# Altium schematic sheet AWR2243_DUT.SchDoc: =ProjectTitle
size A3; PageSetup: Record=PageOptions|CenterHorizontal=True|CenterVertical=True|PrintScale=1.00|XCorrection=1.00|YCorrection=1.00|PrintKind=0|BorderSize=5000000|LeftOffset=0|BottomOffset=0|Orientation=2|PaperLength=1000|PaperWidth=1000|Scale=100|PaperSource=15|PrintQuality=600|MediaType=1|DitherType=10|PaperKind=Letter|PrintScaleMode=1; Author: Jaime I. Chait; Organization: NWES LLC; Address1: 111 SW 5th Ave, STE 3150; Address2: Portland, OR 97204; SheetNumber: 6; SheetTotal: 19
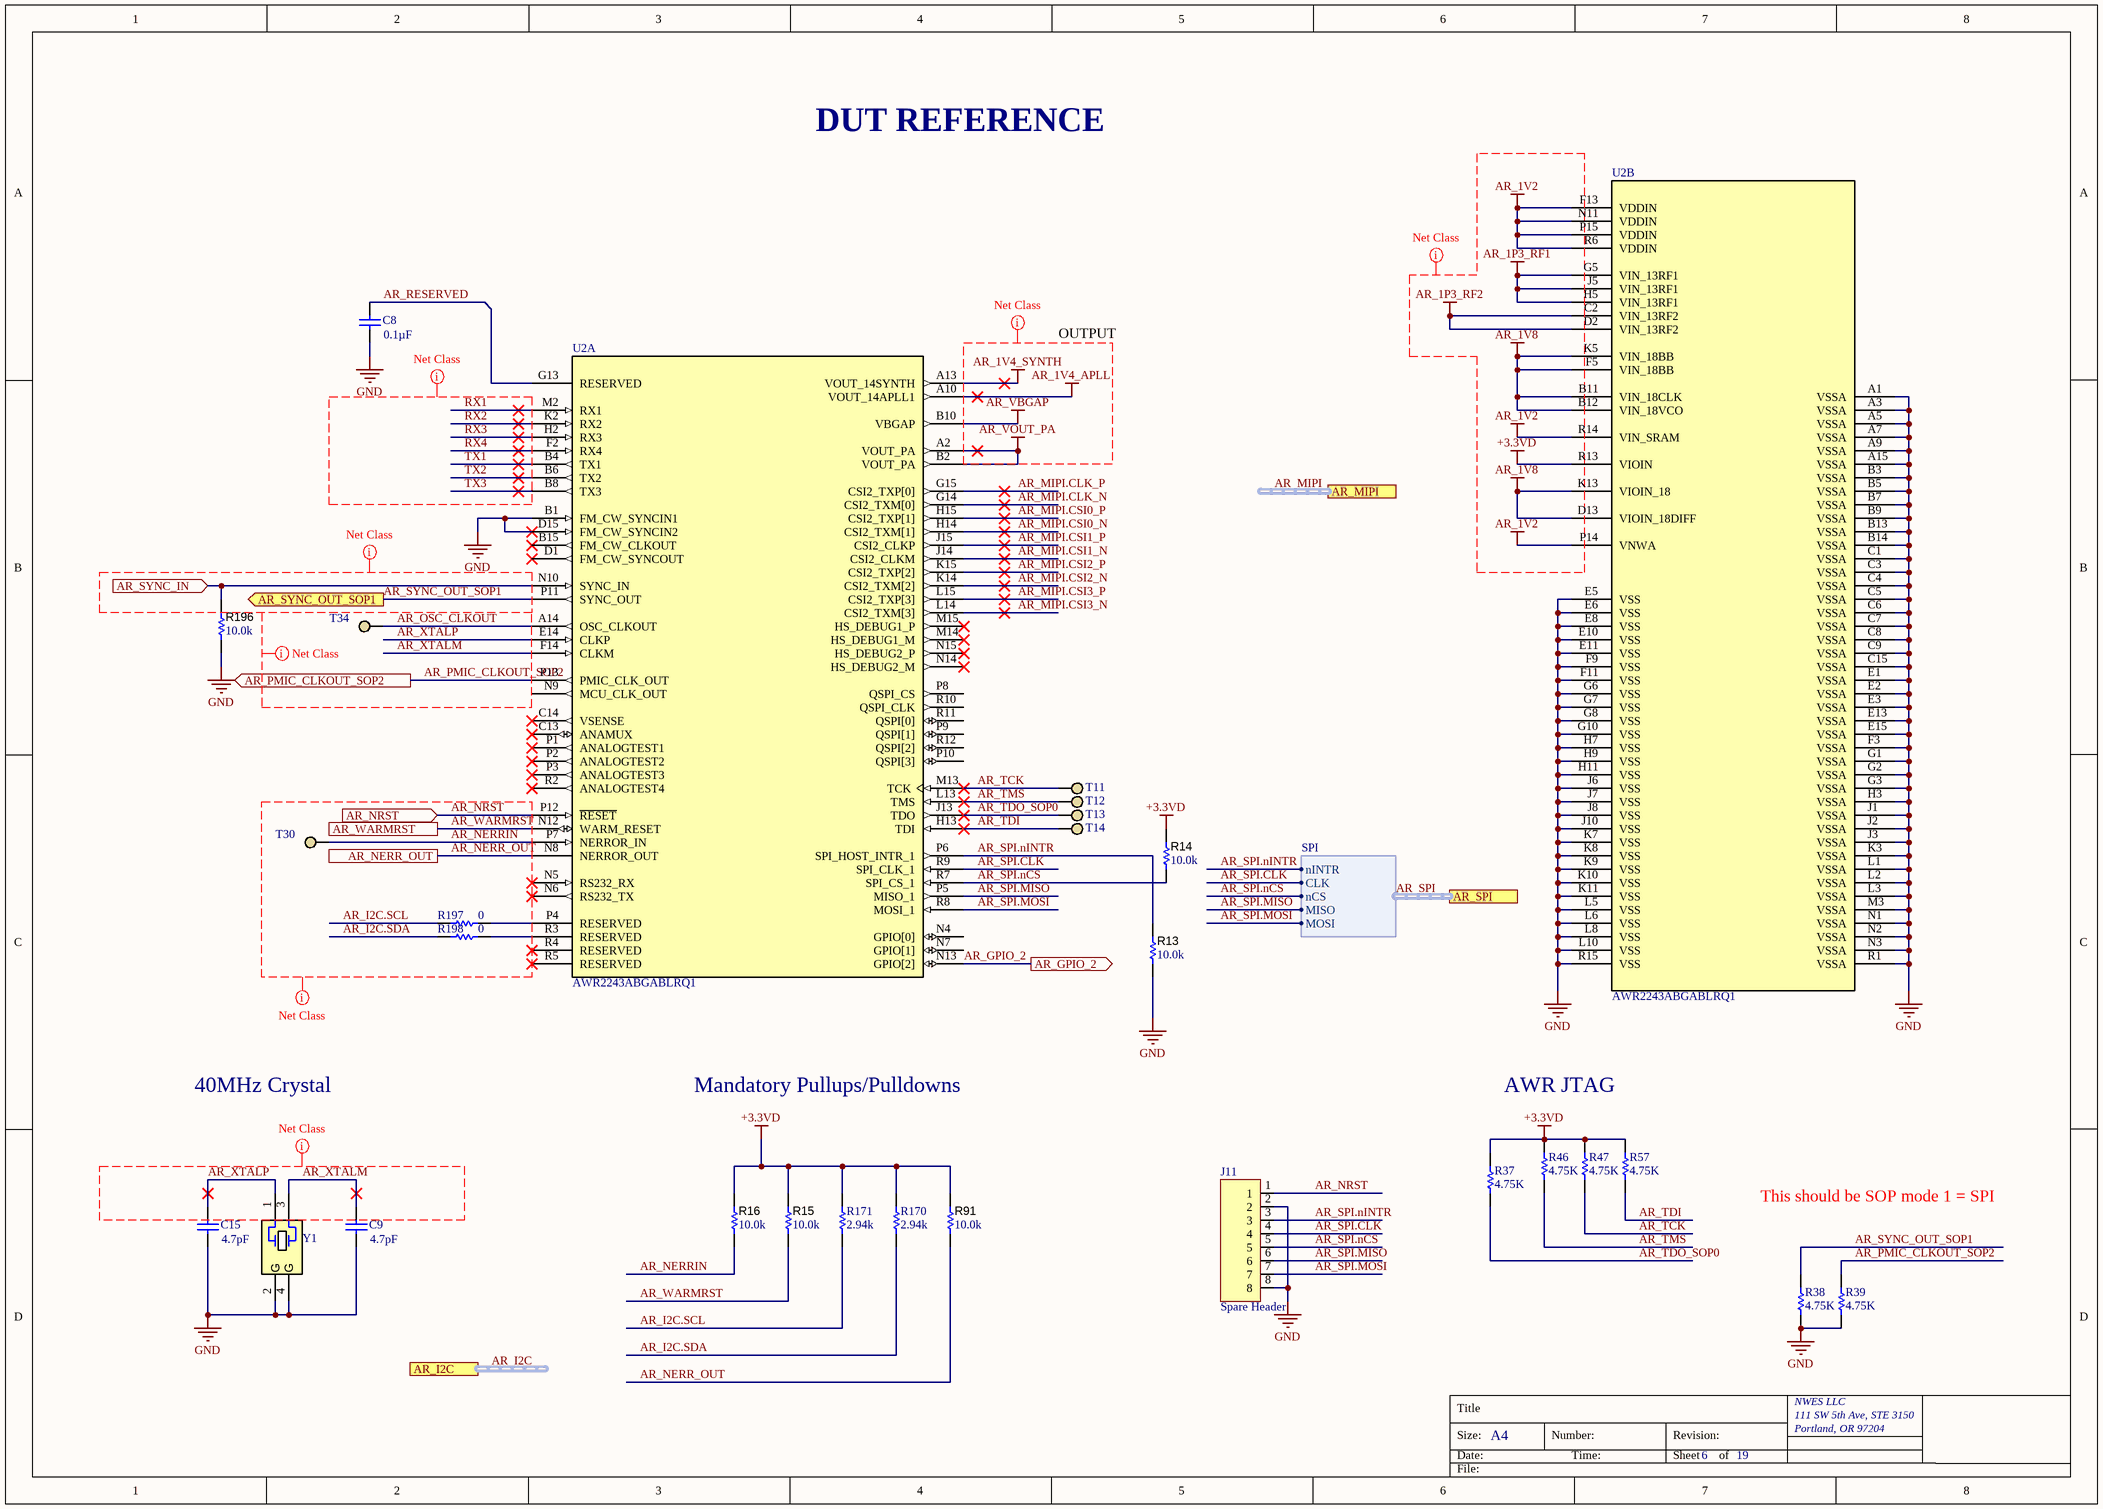
[diagram p0: AWR2243_DUT.SchDoc]

## Parts
C8  ValueDisplayed: 0.1µF  [0201_033]  (hidden comment: C0603X7S1A104K030BC)
C9  ValueDisplayed: 4.7pF  [0402]  (hidden comment: GJM1555C1H4R7BB01D)
C15  ValueDisplayed: 4.7pF  [0402]  (hidden comment: GJM1555C1H4R7BB01D)
J11  Spare Header  [HDR8X1_2.54MM]
R13  ValueDisplayed: 10.0k  [0402L]  (hidden comment: CRCW040210K0FKED)
R14  ValueDisplayed: 10.0k  [0402L]  (hidden comment: CRCW040210K0FKED)
R15  ValueDisplayed: 10.0k  [0402L]  (hidden comment: CRCW040210K0FKED)
R16  ValueDisplayed: 10.0k  [0402L]  (hidden comment: CRCW040210K0FKED)
R37  4.75K  [RESC1005X40USR]
R38  4.75K  [RESC1005X40USR]
R39  4.75K  [RESC1005X40USR]
R46  4.75K  [RESC1005X40USR]
R47  4.75K  [RESC1005X40USR]
R57  4.75K  [RESC1005X40USR]
R91  ValueDisplayed: 10.0k  [0402L]  (hidden comment: CRCW040210K0FKED)
R170  ValueDisplayed: 2.94k  [0402]  (hidden comment: CRCW04022K94FKED)
R171  ValueDisplayed: 2.94k  [0402]  (hidden comment: CRCW04022K94FKED)
R196  ValueDisplayed: 10.0k  [0402L]  (hidden comment: CRCW040210K0FKED)
R197  ValueDisplayed: 0  [0201]  (hidden comment: CRCW02010000Z0ED)
R198  ValueDisplayed: 0  [0201]  (hidden comment: CRCW02010000Z0ED)
T11  TP_S  [TP_SM_1MM]  (value not drawn)  (no BOM)
T12  TP_S  [TP_SM_1MM]  (value not drawn)  (no BOM)
T13  TP_S  [TP_SM_1MM]  (value not drawn)  (no BOM)
T14  TP_S  [TP_SM_1MM]  (value not drawn)  (no BOM)
T30  TP_S  [TP_SM_1MM]  (value not drawn)  (no BOM)
T34  TP_S  [TP_SM_1MM]  (value not drawn)  (no BOM)
U2  PartNumber: AWR2243ABGABLRQ1  [ABL0161A]  (hidden comment: AWR2243APBGABLQ1)  (parts A,B of 2)
Y1  CX3225SA40000D0PTWCC  [Kyocera_CX3225SA]  (value not drawn)

## Ports
AR_GPIO_2 (out), AR_I2C (harness I2C), AR_MIPI (harness AR_MIPI), AR_NERR_OUT, AR_NRST (in), AR_PMIC_CLKOUT_SOP2 (out), AR_SPI (harness SPI), AR_SYNC_IN (in), AR_SYNC_OUT_SOP1 (out), AR_WARMRST

## Harnesses
SPI: nINTR, CLK, nCS, MISO, MOSI

## Nets
+3.3VD: R14.2 R15.2 R16.2 R37.2 R46.2 R47.2 R57.2 R91.2 R170.2 R171.2 U2.R13(VIOIN)
AR_1P3_RF1: U2.G5(VIN_13RF1) U2.H5(VIN_13RF1) U2.J5(VIN_13RF1)
AR_1P3_RF2: U2.C2(VIN_13RF2) U2.D2(VIN_13RF2)
AR_1V2: U2.F13(VDDIN) U2.N11(VDDIN) U2.P14(VNWA) U2.P15(VDDIN) U2.R6(VDDIN) U2.R14(VIN_SRAM)
AR_1V4_APLL: U2.A10(VOUT_14APLL1)
AR_1V4_SYNTH: U2.A13(VOUT_14SYNTH)
AR_1V8: U2.B11(VIN_18CLK) U2.B12(VIN_18VCO) U2.D13(VIOIN_18DIFF) U2.F5(VIN_18BB) U2.K5(VIN_18BB) U2.K13(VIOIN_18)
AR_VBGAP: U2.B10(VBGAP)
AR_VOUT_PA: U2.A2(VOUT_PA) U2.B2(VOUT_PA)
GND: C8.2 C9.2 C15.1 J11.2 J11.8 R13.1 R38.1 R39.1 R196.1 U2.A1(VSSA) U2.A3(VSSA) U2.A5(VSSA) U2.A7(VSSA) U2.A9(VSSA) U2.A15(VSSA) U2.B1(FM_CW_SYNCIN1) U2.B3(VSSA) U2.B5(VSSA) U2.B7(VSSA) U2.B9(VSSA) U2.B13(VSSA) U2.B14(VSSA) U2.C1(VSSA) U2.C3(VSSA) U2.C4(VSSA) U2.C5(VSSA) U2.C6(VSSA) U2.C7(VSSA) U2.C8(VSSA) U2.C9(VSSA) U2.C15(VSSA) U2.D15(FM_CW_SYNCIN2) U2.E1(VSSA) U2.E2(VSSA) U2.E3(VSSA) U2.E5(VSS) U2.E6(VSS) U2.E8(VSS) U2.E10(VSS) U2.E11(VSS) U2.E13(VSSA) U2.E15(VSSA) U2.F3(VSSA) U2.F9(VSS) U2.F11(VSS) U2.G1(VSSA) U2.G2(VSSA) U2.G3(VSSA) U2.G6(VSS) U2.G7(VSS) U2.G8(VSS) U2.G10(VSS) U2.H3(VSSA) U2.H7(VSS) U2.H9(VSS) U2.H11(VSS) U2.J1(VSSA) U2.J2(VSSA) U2.J3(VSSA) U2.J6(VSS) U2.J7(VSS) U2.J8(VSS) U2.J10(VSS) U2.K3(VSSA) U2.K7(VSS) U2.K8(VSS) U2.K9(VSS) U2.K10(VSS) U2.K11(VSS) U2.L1(VSSA) U2.L2(VSSA) U2.L3(VSSA) U2.L5(VSS) U2.L6(VSS) U2.L8(VSS) U2.L10(VSS) U2.M3(VSSA) U2.N1(VSSA) U2.N2(VSSA) U2.N3(VSSA) U2.R1(VSSA) U2.R15(VSS) Y1.2(GND) Y1.4(GND)
AR_GPIO_2: U2.N13(GPIO[2]) ; port AR_GPIO_2
AR_I2C.SCL: R171.1 R197.1
AR_I2C.SDA: R170.1 R198.1
AR_MIPI.CLK_N: U2.G14(CSI2_TXM[0])
AR_MIPI.CLK_P: U2.G15(CSI2_TXP[0])
AR_MIPI.CSI0_N: U2.H14(CSI2_TXM[1])
AR_MIPI.CSI0_P: U2.H15(CSI2_TXP[1])
AR_MIPI.CSI1_N: U2.J14(CSI2_CLKM)
AR_MIPI.CSI1_P: U2.J15(CSI2_CLKP)
AR_MIPI.CSI2_N: U2.K14(CSI2_TXM[2])
AR_MIPI.CSI2_P: U2.K15(CSI2_TXP[2])
AR_MIPI.CSI3_N: U2.L14(CSI2_TXM[3])
AR_MIPI.CSI3_P: U2.L15(CSI2_TXP[3])
AR_NERR_OUT: R91.1 U2.N8(NERROR_OUT) ; port AR_NERR_OUT
AR_NERRIN: R16.1 T30.1 U2.P7(NERROR_IN)
AR_NRST: J11.1 U2.P12(~{RESET}) ; port AR_NRST
AR_OSC_CLKOUT: T34.1 U2.A14(OSC_CLKOUT)
AR_PMIC_CLKOUT_SOP2: R39.2 U2.P13(PMIC_CLK_OUT) ; port AR_PMIC_CLKOUT_SOP2
AR_RESERVED: C8.1 U2.G13(RESERVED)
AR_SPI.CLK: J11.4 U2.R9(SPI_CLK_1) ; port AR_SPI.CLK
AR_SPI.MISO: J11.6 U2.P5(MISO_1) ; port AR_SPI.MISO
AR_SPI.MOSI: J11.7 U2.R8(MOSI_1) ; port AR_SPI.MOSI
AR_SPI.nCS: J11.5 R14.1 U2.R7(SPI_CS_1) ; port AR_SPI.nCS
AR_SPI.nINTR: J11.3 R13.2 U2.P6(SPI_HOST_INTR_1) ; port AR_SPI.nINTR
AR_SYNC_IN: R196.2 U2.N10(SYNC_IN) ; port AR_SYNC_IN
AR_SYNC_OUT_SOP1: R38.2 U2.P11(SYNC_OUT) ; port AR_SYNC_OUT_SOP1
AR_TCK: R47.1 T11.1 U2.M13(TCK)
AR_TDI: R57.1 T14.1 U2.H13(TDI)
AR_TDO_SOP0: R37.1 T13.1 U2.J13(TDO)
AR_TMS: R46.1 T12.1 U2.L13(TMS)
AR_WARMRST: R15.1 U2.N12(WARM_RESET) ; port AR_WARMRST
AR_XTALM: C9.1 U2.F14(CLKM) Y1.3
AR_XTALP: C15.2 U2.E14(CLKP) Y1.1
RX1: U2.M2(RX1)
RX2: U2.K2(RX2)
RX3: U2.H2(RX3)
RX4: U2.F2(RX4)
TX1: U2.B4(TX1)
TX2: U2.B6(TX2)
TX3: U2.B8(TX3)
NetR197_2: R197.2 U2.P4(RESERVED)
NetR198_2: R198.2 U2.R3(RESERVED)

Not connected (* = marked no-connect by the designer): U2 B15(FM_CW_CLKOUT)* C13(ANAMUX)* C14(VSENSE)* D1(FM_CW_SYNCOUT)* M14(HS_DEBUG1_M)* M15(HS_DEBUG1_P)* N4(GPIO[0]) N5(RS232_RX)* N6(RS232_TX)* N7(GPIO[1]) N9(MCU_CLK_OUT) N14(HS_DEBUG2_M)* N15(HS_DEBUG2_P)* P1(ANALOGTEST1)* P2(ANALOGTEST2)* P3(ANALOGTEST3)* P8(QSPI_CS) P9(QSPI[1]) P10(QSPI[3]) R2(ANALOGTEST4)* R4(RESERVED)* R5(RESERVED)* R10(QSPI_CLK) R11(QSPI[0]) R12(QSPI[2])

## Buses and harness runs
harness AR_I2C = port AR_I2C
harness AR_MIPI = port AR_MIPI
harness AR_SPI = port AR_SPI

## Layout directives
net class RF: RX1, RX2, RX3, RX4, TX1, TX2, TX3
net class GENERAL: AR_I2C.SCL, AR_I2C.SDA, AR_NERR_OUT, AR_NERRIN, AR_NRST, AR_SYNC_OUT_SOP1, AR_WARMRST
net class AWR_PWR: +3.3VD, AR_1P3_RF1, AR_1P3_RF2, AR_1V2, AR_1V4_APLL, AR_1V4_SYNTH, AR_1V8, AR_VBGAP, AR_VOUT_PA
net class CLK: AR_OSC_CLKOUT, AR_PMIC_CLKOUT_SOP2, AR_XTALM, AR_XTALP

## Notes on the sheet
- DUT REFERENCE
- OUTPUT
- 40MHz Crystal
- Mandatory Pullups/Pulldowns
- AWR JTAG
- This should be SOP mode 1 = SPI
- Title
- Size:
- Date:
- A4
- Number:
- Time:
- Revision:
- Sheet
- of
- File:
- (in symbol CMP-0004694-3) G

## Library data of the parts
C8 = CMP-0078219-1: CAP, CERM, 0.1 µF, 10 V,+/- 10%, X7S, 0201; Manufacturer: TDK; TaMin_C: -55°C; Polarized: N; Green_Lifecycle: NRND; SizeAreaWB_mm2: 2.08; Green_REACh: Passed; U/M: EA; Value: 0.1uF; TaMax_C: 125°C; SizeZ_mm: 0.33; SizeX_mm: 0.6; SizeY_mm: 0.3; Cap_Case: 0201; Value2: 10V; SizeArea_mm2: 0.18; Cap_F: 100nF; AEC Category: Q200; ComponentLink1URL: https://product.tdk.com/info/en/catalog/datasheets/mlcc_commercial_general_en.pdf; Supplier Part Number 2: 94Y9906; Supplier 2: Newark; Supplier Part Number 3: 810-C0603X7S1A104K; TempCo: X7S; Supplier 3: Mouser; RoHS: Y; MountType: SMT; Green_EU RoHS-2: Passed; Supplier 1: Digi-Key; Green_EU RoHS: Passed; PackageReference: 0201; Tolerance_%: 10%; CompType: Capacitor; PartNumber: C0603X7S1A104K030BC; AEC Qualified: N; VDC_V: 10V; ComponentLink1Description: Datasheet link; AEC Grade: N/A; Supplier Part Number 1: 445-9051-1-ND; Technology: Ceramic
C9 C15 = CMP-0006367-2: CAP, CERM, 4.7 pF, 50 V, +/- 2%, C0G/NP0, 0402; Manufacturer: MuRata; TaMin_C: -55°C; Polarized: N; SizeAreaWB_mm2: 3; Value1: Unknown; U/M: EA; Value: 4.7pF; TaMax_C: 125°C; SizeZ_mm: 0.6; SizeX_mm: 1; SizeY_mm: 0.5; Value2: 50V; CompType: Capacitor; AEC Category: Q200; Supplier Part Number 2: 81-GJM1555C1H4R7BB01; Publisher: Texas Instruments; Supplier 2: Mouser; TempCo: C0G/NP0; Published: 2008-06-19; RoHS: Y; MountType: SMT; Supplier 1: Digi-Key; PackageReference: 0402; Tolerance_%: 2%; Cap_Case: 0402; SizeArea_mm2: 0.5; LatestRevisionDate: 2017-03-09; PartNumber: GJM1555C1H4R7BB01D; AEC Qualified: N; Cap_F: 4.7pF; VDC_V: 50V; ComponentLink1Description: Datasheet link; AEC Grade: N/A; Supplier Part Number 1: 490-8102-1-ND; Technology: Ceramic; ComponentLink1URL: http://psearch.murata.com/capacitor/product/GJM1555C1H4R7BB01%23.pdf
J11 = Header 8X1: Conn Header Vert 8POS 2.54MM; Manufacturer: Sullins; Manufacturer Part Number: PREC008SAAN-RC; Number of Positions: 8; Connector Type: Male Pin; Pitch: 0.1inch; Supplier 1: Digi-Key; RoHS: Yes; Category: Headers and Wire Housings; Stock 1: 4391; Pricing 1: 1=0.19000, 10=0.17800, 25=0.15200, 50=0.13300, 100=0.12360, 250=0.10928, 500=0.10454 (USD); Mount: Through Hole; Color: Black; Contact Plating: Tin; Package Quantity: 1; Number of Rows: 1; Packaging: Bulk; Termination: Solder; Series: -; Contact Type: Male Pin; Contact Mating Length: 0.23inch; RoHS Compliant: Yes; ComponentLink1URL: https://datasheet.ciiva.com/740/zrzczzzszzn-rc-st-11635-b-740837.pdf?src-supplier=Digi-Key; ComponentLink1Description: https://datasheet.ciiva.com/740/zrzczzzszzn-rc-st-11635-b-740837.pdf?src-supplier=Digi-Key; Supplier Part Number 1: S1012EC-08-ND
R13-R16 R91 = CMP-0025958-3: RES, 10.0 k, 1%, 0.063 W, AEC-Q200 Grade 0, 0402; Manufacturer: Vishay-Dale; Power_W: 63mW; TempCo: 100 ppm/C; Value_Code: 10k0; Value: 10.0k; EIA_Code: E96; Res_ohm: 10k; SizeX_mm: 1; SizeY_mm: 0.5; SizeZ_mm: 0.6; Value2: 0.063W; AEC Qualified: Y; VDC_V: 50V; AEC Category: Q200; AEC Grade: 0; Supplier Part Number 2: 52K6595; Supplier 2: Newark; Supplier Part Number 3: 71-CRCW0402-10K-E3; Supplier 3: Mouser; RoHS: E; Value1: 1%; MountType: SMT; Supplier 1: Digi-Key; PackageReference: 0402; Tolerance_%: 1%; SizeArea_mm2: 0.5; CompType: Resistor; PartNumber: CRCW040210K0FKED; ComponentLink1Description: Datasheet link; Supplier Part Number 1: 541-10.0KLCT-ND; Technology: Thick Film; ComponentLink1URL: http://www.vishay.com/docs/20035/dcrcwe3.pdf
R37-R39 R46 R47 R57 = RES 4.75K OHM 1% 1/16W 0402: Manufacturer: YAGEO; Manufacturer Part Number: RC0402FR-074K75L; Supplier Part Number 1: 311-4.75KLCT-ND; Supplier 1: Digi-Key; Height: 0.4mm; Package: 0402; value: 4.75K
R170 R171 = CMP-0026244-2: RES, 2.94 k, 1%, 0.063 W, AEC-Q200 Grade 0, 0402; Manufacturer: Vishay-Dale; Power_W: 63mW; TempCo: 100 ppm/C; Value_Code: 2k94; Value: 2.94k; EIA_Code: E96; SizeX_mm: 1; SizeY_mm: 0.5; SizeZ_mm: 0.6; Value2: 0.063W; AEC Qualified: Y; VDC_V: 50V; AEC Category: Q200; AEC Grade: 0; ComponentLink1URL: http://www.vishay.com/docs/20035/dcrcwe3.pdf; Supplier Part Number 2: 52K6814; Supplier 2: Newark; Supplier Part Number 3: 71-CRCW0402-2.94K-E3; Supplier 3: Mouser; RoHS: E; Value1: 1%; MountType: SMT; Supplier 1: Digi-Key; PackageReference: 0402; Tolerance_%: 1%; Res_ohm: 2.94k; SizeArea_mm2: 0.5; CompType: Resistor; PartNumber: CRCW04022K94FKED; ComponentLink1Description: Datasheet link; Supplier Part Number 1: 541-2.94KLCT-ND; Technology: Thick Film
R196 = CMP-0025958-3: RES, 10.0 k, 1%, 0.063 W, AEC-Q200 Grade 0, 0402; Manufacturer: Vishay-Dale; Power_W: 63mW; TempCo: 100 ppm/C; Value_Code: 10k0; Value: 10.0k; EIA_Code: E96; Res_ohm: 10k; SizeX_mm: 1; SizeY_mm: 0.5; SizeZ_mm: 0.6; Value2: 0.063W; CompType: Resistor; AEC Qualified: Y; VDC_V: 50V; AEC Category: Q200; AEC Grade: 0; Supplier Part Number 2: 52K6595; Supplier 2: Newark; Supplier Part Number 3: 71-CRCW0402-10K-E3; Supplier 3: Mouser; RoHS: E; Value1: 1%; MountType: SMT; Supplier 1: Digi-Key; PackageReference: 0402; Tolerance_%: 1%; SizeArea_mm2: 0.5; PartNumber: CRCW040210K0FKED; ComponentLink1Description: Datasheet link; Supplier Part Number 1: 541-10.0KLCT-ND; Technology: Thick Film; ComponentLink1URL: http://www.vishay.com/docs/20035/dcrcwe3.pdf
R197 R198 = CMP-0027008-4: RES, 0, 5%, 0.05 W, 0201; Manufacturer: Vishay-Dale; Power_W: 50mW; TempCo: ppm/C; Value_Code: 0000; Value: 0; EIA_Code: E24; SizeX_mm: 0.6; SizeY_mm: 0.3; SizeZ_mm: 0.26; Value2: 0.05W; SizeArea_mm2: 0.18; AEC Qualified: N; AEC Category: Q200; RoHS: E; Value1: 5%; MountType: SMT; Supplier 1: Newark; PackageReference: 0201; Tolerance_%: 5%; Res_ohm: 0; CompType: Resistor; PartNumber: CRCW02010000Z0ED; ComponentLink1Description: Datasheet link; AEC Grade: N/A; Supplier Part Number 1: 72M6743; Technology: Thick Film; ComponentLink1URL: http://www.vishay.com/docs/20052/crcw0201e3.pdf
T11-T14 T30 T34 = Test point PAD: test point
U2 = CMP-0081285-1: Single Chip 77 and 79 GHz FMCW Transceiver, ABL0161A (FCBGA-161); Alternate Manufacturer: Texas Instruments; SizeAreaWB_mm2: 153.76; SizeZ_mm: 1.17; SizeX_mm: 10.4; SizeArea_mm2: 108.16; CompType: IC; AEC Qualified: N; AEC Category: Q200; ComponentLink1URL: http://www.ti.com/lit/ds/symlink/awr1243.pdf; Alternate PartNumber: AWR2243ABGABLRQ1; PackageDescription: FCBGA-161; MountType: SMT; ComponentLink2URL: http://www.ti.com/product/awr1243; ComponentLink3Description: Online Datasheet; ComponentLink2Description: Product Folder; Manufacturer: Texas Instruments; ComponentLink3URL: http://www.ti.com/product/awr1243/datasheet; PackageReference: ABL0161A; SizeY_mm: 10.4; ComponentLink1Description: Datasheet Link; PartId: 1
Y1 = CMP-0004694-3: Crystal, 40 MHz, 8pF, SMD; Manufacturer: Kyocera; TaMin_C: -40°C; Frequency Stability: +/-200ppm; SizeAreaWB_mm2: 14.7; Frequency_Fixed: 40MHz; TaMax_C: 125°C; SizeZ_mm: 0.8; SizeX_mm: 2.5; SizeY_mm: 3.2; SizeArea_mm2: 8; RoHS: Y; MountType: SMT; Supplier 1: Mouser; PackageReference: 3.2x2.5mm; CompType: Crystal; PartNumber: CX3225SA40000D0PTWCC; ComponentLink1Description: Datasheet Link; Supplier Part Number 1: 581-CX3225SA40D0PTWC; ComponentLink1URL: http://www.kyocera-crystal.jp/eng/wp-content/uploads/2016/10/cx3225sa_e.pdf